# EAGLE design FullPower (EAGLE 6.1)
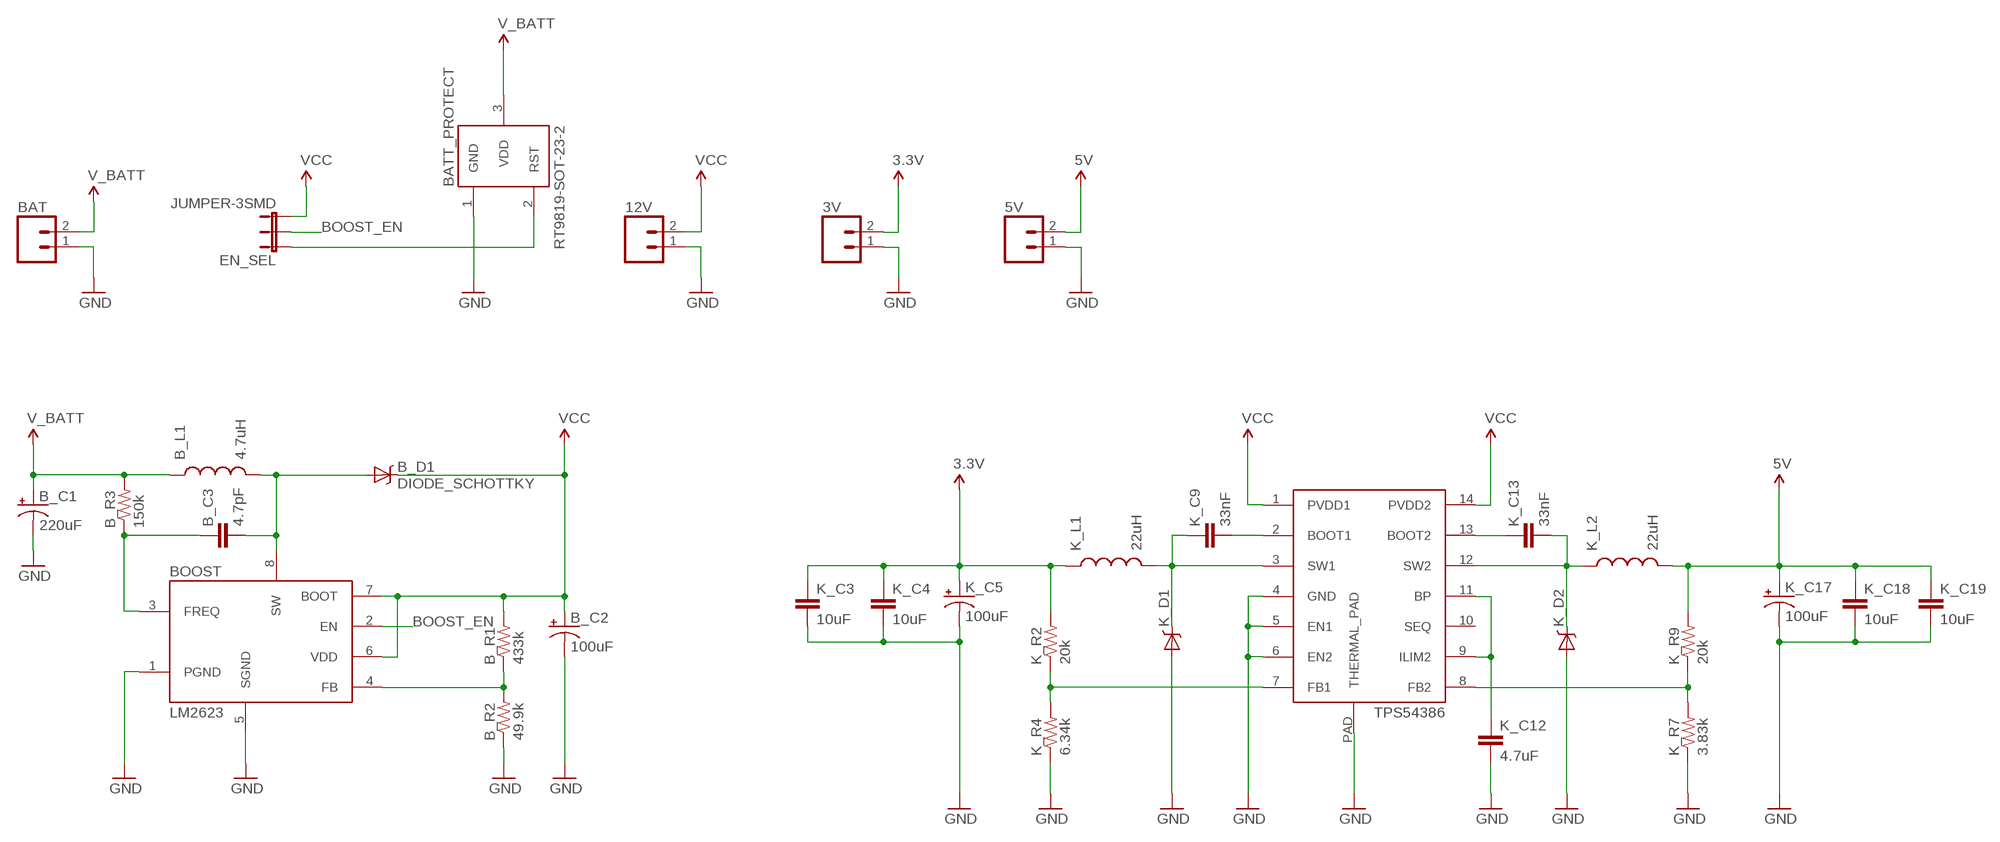
[diagram p0: schematic, sheet 1]

## Parts
3V  M02PTH  [1X02]
5V  M02PTH  [1X02]
12V  M02PTH  [1X02]
B_C1  220uF  CAP_POL3528  [EIA3528]
B_C2  100uF  CAP_POL7343  [EIA7343]
B_C3  4.7pF  CAP_CER-1608(0603)  [CAP-1608]
B_D1  DIODE_SCHOTTKY  [DO-214AB]
B_L1  4.7uH  INDUCTOR-SRR7032  [INDUCTOR_SRR7032]
B_R1  433k  RESISTOR0805-RES  [0805]
B_R2  49.9k  RESISTOR0805-RES  [0805]
B_R3  150k  RESISTOR0805-RES  [0805]
BAT  M02PTH  [1X02]
BATT_PROTECT  RT9819-SOT-23-2  [SOT-23-2]
BOOST  LM2623  LM2623-MSOP-8  [MSOP-8]
BUCK  TPS54386  TPS54386-HTSSOP-14  [HTSSOP-14]
EN_SEL  JUMPER-3SMD  [SJ_3]
K_C3  10uF  CAP_CER-2012(0805)  [CAP-2012]
K_C4  10uF  CAP_CER-2012(0805)  [CAP-2012]
K_C5  100uF  CAP_POL-PANASONIC-F  [PANASONIC-F]
K_C9  33nF  CAP_CER-1608(0603)  [CAP-1608]
K_C12  4.7uF  CAP_CER-2012(0805)  [CAP-2012]
K_C13  33nF  CAP_CER-1608(0603)  [CAP-1608]
K_C17  100uF  CAP_POL-PANASONIC-F  [PANASONIC-F]
K_C18  10uF  CAP_CER-2012(0805)  [CAP-2012]
K_C19  10uF  CAP_CER-2012(0805)  [CAP-2012]
K_D1  DIODE_SCHOTTKY  [DO-214AB]
K_D2  DIODE_SCHOTTKY  [DO-214AB]
K_L1  22uH  INDUCTOR-PF0560  [INDUCTOR-PF0560NL]
K_L2  22uH  INDUCTOR-PF0560  [INDUCTOR-PF0560NL]
K_R2  20k  RESISTOR0805-RES  [0805]
K_R4  6.34k  RESISTOR0805-RES  [0805]
K_R7  3.83k  RESISTOR0805-RES  [0805]
K_R9  20k  RESISTOR0805-RES  [0805]

## Nets
1.8V: B_C1.A(+) B_L1.2 B_R3.2 BAT.2 BATT_PROTECT.3(VDD) ; supply symbol labelled V_BATT
3.3V: 3V.2 K_C3.+ K_C4.+ K_C5.+ K_L1.2 K_R2.2
5V: 5V.2 K_C17.+ K_C18.+ K_C19.+ K_L2.1 K_R9.2
BOOST_EN: BOOST.2(EN) EN_SEL.2
GND: 3V.1 5V.1 12V.1 B_C1.C(-) B_C2.C(-) B_R2.1 BAT.1 BATT_PROTECT.1(GND) BOOST.1(PGND) BOOST.5(SGND) BUCK.4(GND) BUCK.5(EN1) BUCK.6(EN2) BUCK.PAD(THERMAL_PAD) K_C3.- K_C4.- K_C5.- K_C12.- K_C17.- K_C18.- K_C19.- K_D1.A K_D2.A K_R4.1 K_R7.1
N$1: B_R1.1 B_R2.2 BOOST.4(FB)
N$2: BUCK.3(SW1) K_C9.+ K_D1.C K_L1.1
N$3: BUCK.12(SW2) K_C13.- K_D2.C K_L2.2
N$5: B_C3.- B_D1.A B_L1.1 BOOST.8(SW)
N$6: B_C3.+ B_R3.1 BOOST.3(FREQ)
N$8: BUCK.7(FB1) K_R2.1 K_R4.2
N$9: BUCK.8(FB2) K_R7.2 K_R9.1
N$10: BUCK.9(ILIM2) BUCK.11(BP) K_C12.+
N$11: BUCK.2(BOOT1) K_C9.-
N$12: BUCK.13(BOOT2) K_C13.+
N$13: BATT_PROTECT.2(RST) EN_SEL.1
VCC: 12V.2 B_C2.A(+) B_D1.C B_R1.2 BOOST.6(VDD) BOOST.7(BOOT) BUCK.1(PVDD1) BUCK.14(PVDD2) EN_SEL.3
Unconnected: BUCK.10(SEQ)

## Library data of the parts
3V 5V 12V BAT = SparkFun-Connectors:M02: Header 2 Standard 2-pin 0.1" header. Use with straight break away headers (SKU : PRT-00116), right angle break away headers (PRT-00553), swiss pins (PRT-00743), machine pins (PRT-00117), and female headers (PRT-00115). Molex polarized connector foot print use with SKU : PRT-08233 with associated crimp pins and housings.
B_C1 B_C2 = SparkFun-Passives:CAP_POL: Capacitor Polarized These are standard SMD and PTH capacitors. Normally 10uF, 47uF, and 100uF in electrolytic and tantalum varieties. Always verify the external diameter of the through hole cap, it varies with capacity, voltage, and manufacturer. The EIA devices should be standard.
B_C3 K_C3 K_C4 K_C9 K_C12 K_C13 K_C18 K_C19 = OpenSpace:CAP_CER
B_D1 K_D1 K_D2 = OpenSpace:DIODE_SCHOTTKY
B_L1 K_L1 K_L2 = OpenSpace:INDUCTOR
B_R1-B_R3 K_R2 K_R4 K_R7 K_R9 = SparkFun-Passives:RESISTOR: Resistor Basic schematic elements and footprints for 0603, 1206, and PTH resistors.
BATT_PROTECT = OpenSpace:RT9819
BOOST = OpenSpace:LM2623
BUCK = OpenSpace:TPS54386
EN_SEL = SparkFun-Passives:JUMPER-3
K_C5 K_C17 = OpenSpace:CAP_POL

## Board
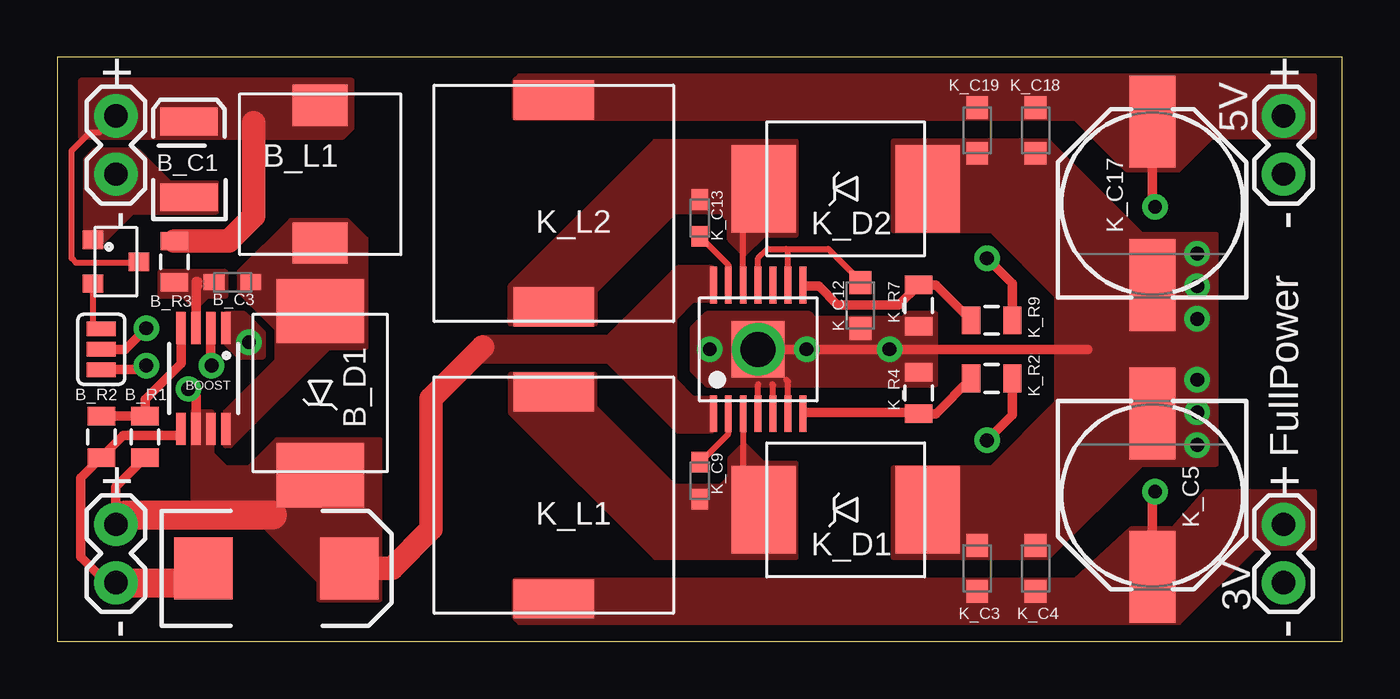
[diagram p1: board, top side]
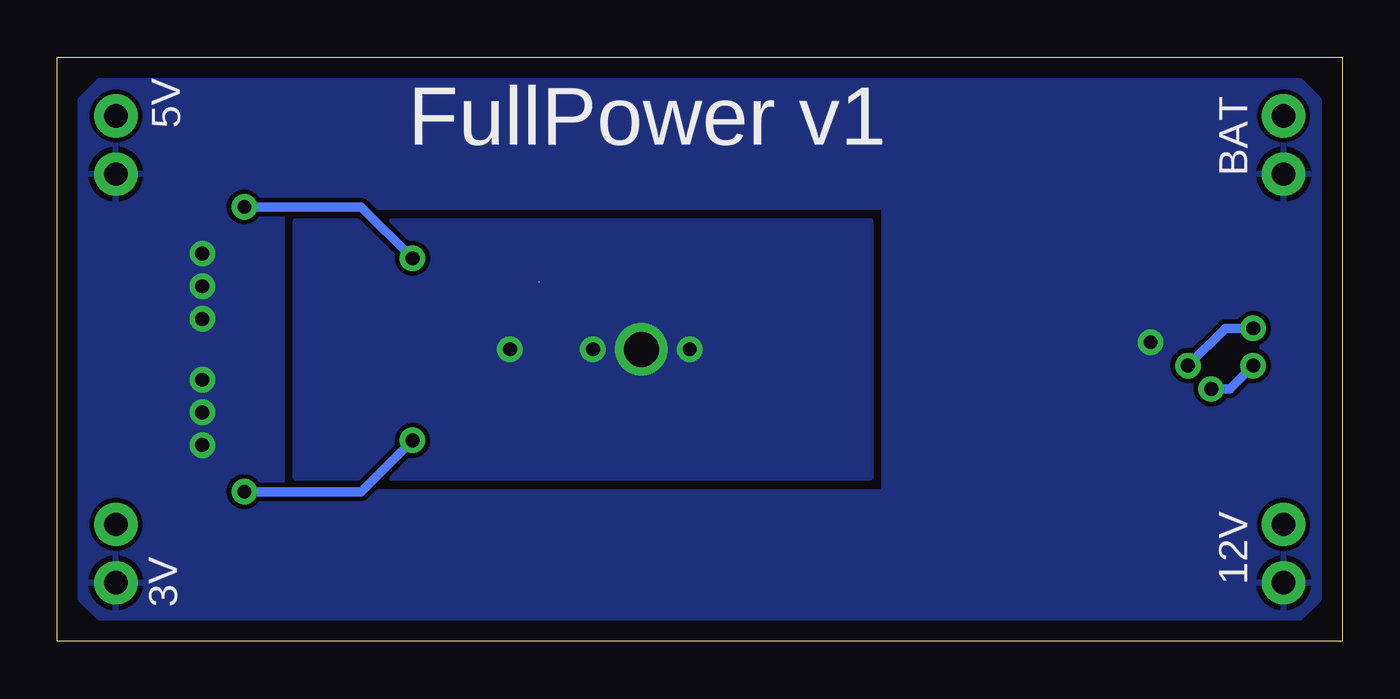
[diagram p2: board, bottom side, seen from below]

Size 55.88 x 25.4 mm. Coordinates in mm from the lower left corner, seen from the top.
Outline: 0,0 55.88,0 55.88,25.4 0,25.4 0,0
Copper layers (1*16): Top 0.035mm / dielectric 1.5mm / Bottom 0.035mm
Design rules: minimum track width 8mil, minimum drill 20mil, track to track 8mil, track to pad 8mil, pad to pad 8mil, via to via 8mil, smd to smd 8mil, copper to edge 10mil, drill to drill 8mil, minimum pad ring 12mil, minimum via ring 10mil, stop-mask expansion 4mil, vias tented up to drill 25mil, thermal gap 10mil

### Footprints (pad centres in the part's own frame; a part is rotated, then mirrored left to right if it is on the bottom)
1X02 = drill 1.016 pad 1.88: 1 0,0; 2 2.54,0
EIA3528 = smd 1.2 x 2.5: A 1.65,0; C -1.65,0
EIA7343 = smd 2.55 x 2.7: A 3.17,0; C -3.17,0
CAP-1608 = smd 0.9 x 0.7: + 0.8,0; - -0.8,0
DO-214AB = smd 2.794 x 3.81: A -3.568,0; C 3.568,0
INDUCTOR_SRR7032 = smd 2.4 x 1.8: 1 0,-3; 2 0,3
0805 = smd 0.8 x 1.2: 1 -0.9,0; 2 0.9,0
SOT-23-2 = smd 0.8 x 0.9: 1 -0.95,-1; 2 0.95,-1; 3 0,1
MSOP-8 = smd 0.41 x 1.4: 1 -0.975,-2.2; 2 -0.325,-2.2; 3 0.325,-2.2; 4 0.975,-2.2; 5 0.975,2.2; 6 0.325,2.2; 7 -0.325,2.2; 8 -0.975,2.2
HTSSOP-14 = smd 1.6 x 0.3: 1 -2.8,1.95; 2 -2.8,1.3; 3 -2.8,0.65; 4 -2.8,0; 5 -2.8,-0.65; 6 -2.8,-1.3; 7 -2.8,-1.95; 8 2.8,-1.95; 9 2.8,-1.3; 10 2.8,-0.65; 11 2.8,0; 12 2.8,0.65; 13 2.8,1.3; 14 2.8,1.95 | smd 2.46 x 2.31: PAD 0,0
SJ_3 = smd 0.635 x 1.27: 1 -0.889,0; 2 0,0; 3 0.889,0
CAP-2012 = smd 1 x 0.95: + 1,0; - -1,0
PANASONIC-F = smd 4 x 2: + 3.55,0; - -3.55,0
INDUCTOR-PF0560NL = smd 3.5 x 1.7: 1 0,-4.5; 2 0,4.5

### Placement (x,y rotation side)
3V  53.34,2.54 90 top
5V  53.34,20.32 90 top
12V  2.54,2.54 90 top
B_C1  5.71,20.95 90 top
B_C2  9.53,3.17 0 top
B_C3  7.62,15.62 180 top
B_D1  11.43,10.79 270 top
B_L1  11.43,20.32 0 top
B_R1  3.81,8.89 270 top
B_R2  1.91,8.89 90 top
B_R3  5.08,16.51 90 top
BAT  2.54,20.32 90 top
BATT_PROTECT  2.54,16.51 270 top
BOOST  6.35,11.43 180 top
BUCK  30.48,12.7 90 top
EN_SEL  1.91,12.7 270 top
K_C3  40.01,3.17 270 top
K_C4  42.55,3.17 270 top
K_C5  47.62,6.35 270 top
K_C9  27.94,6.99 270 top
K_C12  34.92,14.61 90 top
K_C13  27.94,18.41 270 top
K_C17  47.62,19.05 90 top
K_C18  42.55,22.23 90 top
K_C19  40.01,22.23 90 top
K_D1  34.29,5.71 180 top
K_D2  34.29,19.68 180 top
K_L1  21.59,6.35 180 top
K_L2  21.59,19.05 180 top
K_R2  40.64,11.43 0 top
K_R4  37.47,10.79 270 top
K_R7  37.47,14.61 90 top
K_R9  40.64,13.97 0 top

### Tracks (layer width: path | path; a pad name or v marks a point on that pad's centre or on a via)
1.8V
  Top 0.254: BATT_PROTECT.3 3.54,16.46 0.81,16.46 0.61,16.66 0.61,21.34 1.42,22.15 1.83,22.15
  Top 1.016: B_R3.2 7.45,17.41 8.53,18.49 8.53,22.55
  pour Top (no thermals): 12.8,24.38 1.02,24.38 1.02,21.95 12.4,21.95 12.8,22.35
3.3V  (via drill 0.6)
  Top 0.406: K_R2.2 41.54,9.84 v40.44,8.74 | v47.75,6.5 47.62,6.38 K_C5.+
  Bottom 0.406: v40.44,8.74 42.67,6.5 v47.75,6.5
  pour Top (no thermals): 19.91,2.64 44.3,2.64 46.74,4.88 48.56,4.88 49.99,6.5 54.66,6.5 54.66,4.06 52.02,4.06 48.77,0.81 20.12,0.81 19.91,1.02
5V  (via drill 0.6)
  Top 0.406: K_R9.2 41.54,15.56 v40.44,16.66 | v47.75,18.9 47.62,19.02 K_C17.+
  Bottom 0.406: v40.44,16.66 42.67,18.9 v47.75,18.9
  pour Top (no thermals): 54.66,24.59 54.66,21.95 50.19,21.95 48.77,20.52 46.53,20.52 44.3,22.76 19.91,22.76 19.91,24.38 20.12,24.59
BOOST_EN  (via drill 0.6)
  Top 0.406: EN_SEL.2 2.95,12.7 v3.86,13.61 | BOOST.2 6.67,11.99 v6.71,11.99
  Bottom 0.406: v3.86,13.61 5.08,13.61 v6.71,11.99
GND  (via drill 0.6, 1.52)
  Top 0.254: BUCK.4 30.48,11.18 | BUCK.6 31.78,11.3 31.7,11.38 | BUCK.5 31.13,11.14 31.09,11.18
  Top 0.406: BUCK.PAD v32.59,12.7 v36.2,12.7 44.83,12.7 | 12V.1 2.13,2.54 1.02,3.66 1.02,7.1 B_R2.1 2.86,8.94 5.38,8.94 BOOST.5
  Top 1.016: 5.72,2.54 B_C2.C
  Top 1.27: 12V.1 5.72,2.54
  other vias: 30.48,12.7 49.58,8.53 49.58,9.96 49.58,11.38 8.33,13 28.37,12.7 49.58,15.44 49.58,14.02 49.58,16.87
  pour Top (no thermals): 27.64,13.61 27.64,11.79 28.24,11.18 38.2,11.18 38.2,14.22 36.98,14.22 36.78,14.02 32.92,14.02 32.72,14.22 28.24,14.22
  pour Bottom: 45.52,18.29 20.52,18.29 20.52,7.11 45.52,7.11
  pour Top (no thermals): 7.32,14.22 7.32,13 7.92,12.4 8.94,12.4 8.94,13.41 8.13,14.22
  pour Bottom: 1.02,23.57 1.02,1.83 1.83,1.02 54.05,1.02 54.86,1.83 54.86,6.5 19.91,6.5 19.91,18.9 54.86,18.9 54.86,23.57 54.05,24.38 1.83,24.38
  pour Bottom (no thermals): 54.86,18.9 46.13,18.9 46.13,6.5 54.86,6.5
  pour Top (no thermals): 6.91,18.69 6.91,19.91 4.88,19.91 3.45,21.34 1.63,21.34 1.22,20.93 1.22,17.27 1.83,17.27 3.25,18.69
  pour Top (no thermals): 36.37,17.88 40.64,17.88 43.48,15.04 43.48,10.36 40.64,7.52 36.37,7.52 36.37,3.66 43.08,3.66 47.14,7.72 50.39,7.72 50.39,17.68 47.14,17.68 43.08,21.74 36.37,21.74
N$1
  Top 0.406: B_R2.2 B_R1.1 3.81,10.52 5.38,12.08 BOOST.4
N$2
  Top 0.254: BUCK.3 29.83,7.11 29.87,7.11
  pour Top (no thermals): 32.11,7.72 30.68,7.72 29.87,8.53 29.26,7.92 29.26,7.11 28.85,6.71 26.82,6.71 23.37,10.16 23.37,11.58 19.71,11.58 19.71,9.96 26.01,3.66 32.11,3.66
N$3
  Top 0.254: BUCK.12 29.83,19.51 29.87,19.51
  pour Top (no thermals): 29.87,16.87 29.26,17.48 29.26,18.29 28.85,18.69 26.82,18.69 23.37,15.24 23.37,13.82 19.71,13.82 19.71,15.44 26.01,21.74 32.11,21.74 32.11,17.68 30.68,17.68
N$5
  pour Top (no thermals): 7.32,9.96 7.32,8.53 7.52,8.53 11.79,12.8 13.41,12.8 13.41,17.48 12.6,18.29 10.16,18.29 7.92,16.05 7.92,15.24 9.55,13.61 9.55,12.19
N$6
  Top 0.406: 6.03,15.44 6.1,15.44 | BOOST.3 6.03,15.65 6.1,15.65
  pour Top (no thermals): 6.1,14.63 6.5,15.04 7.32,15.04 7.32,16.05 4.47,16.05 4.47,15.04 5.49,15.04 5.89,14.63
N$8
  Top 0.254: BUCK.7 32.45,9.9 32.51,9.96
  Top 0.406: K_R2.1 38.2,9.89 K_R4.2 37.4,9.96 32.51,9.96
N$9
  Top 0.254: 32.51,15.44 32.49,15.44 BUCK.8
  Top 0.406: K_R9.1 38.2,15.51 K_R7.2 36.59,14.63 33.93,14.63 33.12,15.44 32.51,15.44
N$10  (1 unrouted)
  Top 0.254: BUCK.11 30.48,16.66 30.89,17.07 31.7,17.07 | 31.7,17.07 33.53,17.07 34.95,15.65 | BUCK.9 31.78,16.99 31.7,17.07
N$11
  Top 0.254: K_C9.- 29.18,9.03 BUCK.2
N$12
  Top 0.254: K_C13.+ 29.18,16.38 BUCK.13
N$13
  Top 0.254: BATT_PROTECT.2 1.54,13.59 EN_SEL.1
VCC  (via drill 0.6)
  Top 0.406: B_R1.2 2.54,6.72 12V.2 | BOOST.6 6.03,10.64 v5.69,10.97 | v3.86,11.99 3.68,11.81 EN_SEL.3
  Top 1.016: 12V.2 2.95,5.49 | B_C2.A 14.55,3.17 16.26,4.88 16.26,10.57 18.49,12.8
  Top 1.27: 2.95,5.49 9.35,5.49
  Bottom 0.406: v5.69,10.97 4.88,10.97 v3.86,11.99
  pour Top (no thermals): 28.45,9.14 27.03,9.14 23.98,12.19 18.49,12.19 18.49,13.21 23.98,13.21 27.03,16.26 28.45,16.26 28.45,14.83 27.64,14.83 26.82,14.02 26.82,11.38 27.64,10.57 28.45,10.57
  pour Top (no thermals): 5.89,9.96 5.89,5.08 8.94,5.08 11.38,2.64 11.38,1.83 14.02,1.83 14.02,8.74 9.55,8.74 8.33,7.52 7.32,7.52 6.71,8.13 6.71,9.96

### Text on the board
tNames: + | + | - | - | FullPower | + | + | - | -
bNames: 5V | FullPower v1 | 3V
tValues: SAFE